# Altium schematic sheet drv8313.SchDoc
size A4
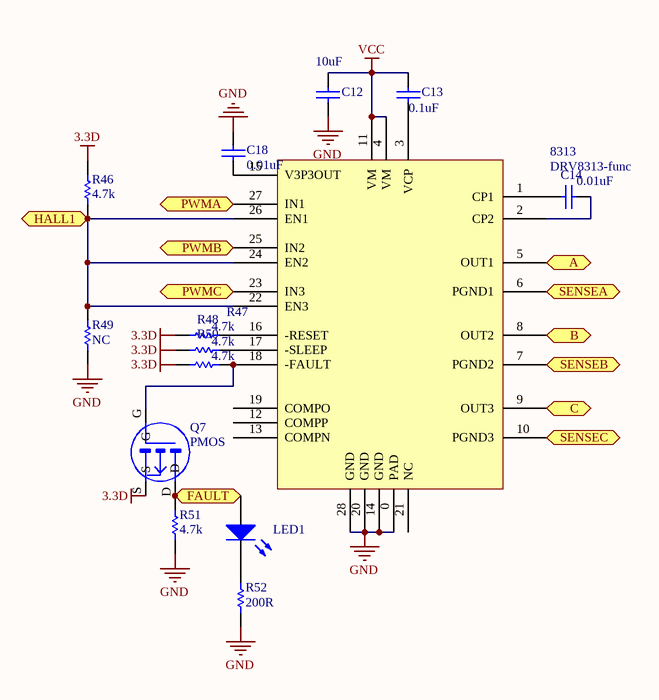
[diagram p0: drv8313.SchDoc]

## Parts
8313  DRV8313-func  [DRV8313]
C12  10uF  [0805]
C13  0.1uF  [0603]
C14  0.01uF  [0603]
C18  0.01uF  [0603]
LED1  LED0  [0603]  (value not drawn)
Q7  PMOS  [SOT-23B_L]
R46  4.7k  [0603]
R47  4.7k  [0603]
R48  4.7k  [0603]
R49  NC  [0603]
R50  4.7k  [0603]
R51  4.7k  [0603]
R52  200R  [0603]

## Ports
A, B, C, FAULT, HALL1, PWMA, PWMB, PWMC, SENSEA, SENSEB, SENSEC

## Nets
3.3D: Q7.S R46.1 R47.1 R48.1 R50.1
GND: 8313.0(PAD) 8313.14(GND) 8313.20(GND) 8313.28(GND) C12.1 C18.2 R49.2 R51.1 R52.1
VCC: 8313.4(VM) 8313.11(VM) C12.2 C13.1
A: 8313.5(OUT1) ; port A
B: 8313.8(OUT2) ; port B
C: 8313.9(OUT3) ; port C
FAULT: LED1.1(A) Q7.D R51.2 ; port FAULT
HALL1: 8313.22(EN3) 8313.24(EN2) 8313.26(EN1) R46.2 R49.1 ; port HALL1
PWMA: 8313.27(IN1) ; port PWMA
PWMB: 8313.25(IN2) ; port PWMB
PWMC: 8313.23(IN3) ; port PWMC
SENSEA: 8313.6(PGND1) ; port SENSEA
SENSEB: 8313.7(PGND2) ; port SENSEB
SENSEC: 8313.10(PGND3) ; port SENSEC
Net8313_1: 8313.1(CP1) C14.1
Net8313_2: 8313.2(CP2) C14.2
Net8313_3: 8313.3(VCP) C13.2
Net8313_15: 8313.15(V3P3OUT) C18.1
Net8313_16: 8313.16(-RESET) R47.2
Net8313_17: 8313.17(-SLEEP) R48.2
Net8313_18: 8313.18(-FAULT) Q7.G R50.2
NetLED1_2: LED1.2(K) R52.2

Not connected (* = marked no-connect by the designer): 8313 12(COMPP) 13(COMPN) 19(COMPO) 21(NC)

## Library data of the parts
C12 C13 = Cap: Capacitor; Published: 8-Jun-2000; LatestRevisionDate: 17-Jul-2002; LatestRevisionNote: Re-released for DXP Platform.; PackageReference: RAD-0.3; Publisher: Altium Limited; PackageDescription: Radial Cap, Thru-Hole; 2 Leads; 0.3 in Pin Spacing
  C12: Value: 10uF
  C13: Value: 0.1uf
C14 C18 = Cap: Capacitor; Value: 0.1uf; Published: 8-Jun-2000; LatestRevisionDate: 17-Jul-2002; LatestRevisionNote: Re-released for DXP Platform.; PackageReference: RAD-0.3; Publisher: Altium Limited; PackageDescription: Radial Cap, Thru-Hole; 2 Leads; 0.3 in Pin Spacing
LED1 = LED0: LED; Published: 8-Jun-2000; LatestRevisionDate: 08-Jul-2005; LatestRevisionNote: Mech Layer 1 removed.; PackageReference: LED-0; Publisher: Altium Limited; PackageDescription: LED; 2 Leads
Q7 = PMOS: pin to pad: D>3 G>1 S>2
R46-R52 = Res1: Resistor; Value: 10K; Published: 8-Jun-2000; LatestRevisionDate: 17-Jul-2002; LatestRevisionNote: Re-released for DXP Platform.; PackageReference: AXIAL-0.3; Publisher: Altium Limited; PackageDescription: Axial Device, Thru-Hole; 2 Leads; 0.3 in Pin Spacing